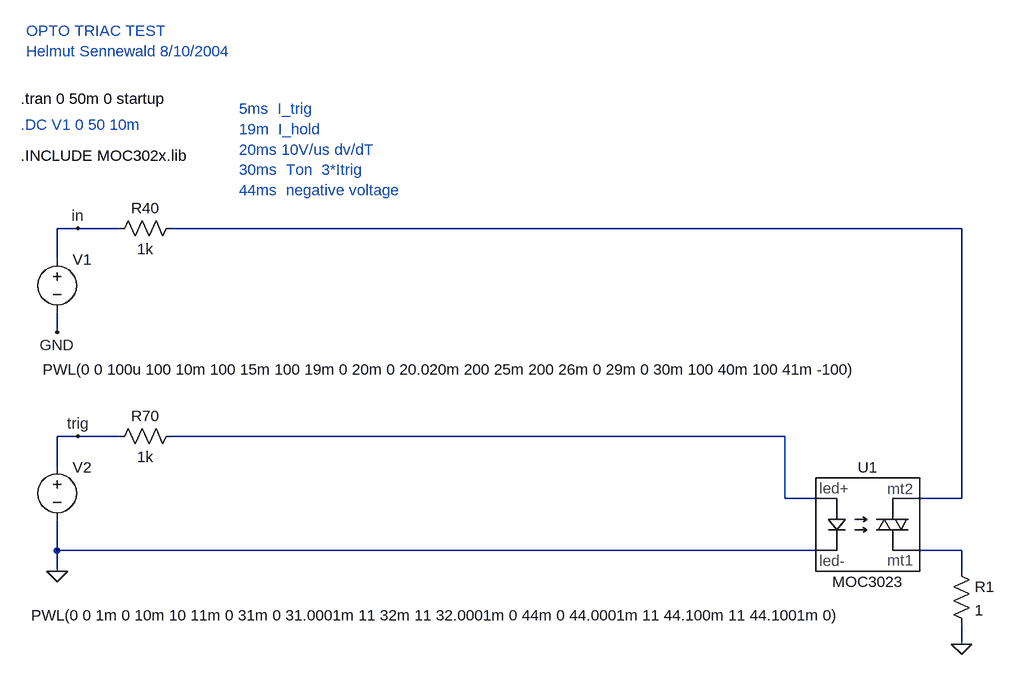
[diagram p0: schematic moc302x_test.asc]
moc302x_test.asc, the LTspice schematic file:
Version 4
SHEET 1 2328 1460
WIRE 80 448 80 400
WIRE 80 400 112 400
WIRE 80 528 80 560
WIRE 1472 400 256 400
WIRE 80 848 80 896
WIRE 176 720 112 720
WIRE 80 896 1248 896
WIRE 1200 720 256 720
WIRE 1248 816 1200 816
WIRE 1200 816 1200 720
WIRE 80 768 80 720
WIRE 1408 816 1472 816
WIRE 1472 816 1472 400
WIRE 1408 896 1472 896
WIRE 80 896 80 928
WIRE 1472 928 1472 896
WIRE 1472 1008 1472 1040
WIRE 112 400 176 400
WIRE 112 720 80 720
FLAG 80 560 GND
FLAG 80 928 0
FLAG 1472 1040 0
FLAG 112 400 in
FLAG 112 720 trig
SYMBOL res 160 416 R270
WINDOW 0 32 56 VTop 0
WINDOW 3 0 56 VBottom 0
SYMATTR InstName R40
SYMATTR Value 1k
SYMBOL voltage 80 432 R0
WINDOW 39 0 0 Left 0
WINDOW 123 0 0 Left 0
WINDOW 3 -22 185 Left 0
SYMATTR Value PWL(0 0 100u 100 10m 100 15m 100 19m 0 20m 0 20.020m 200 25m 200 26m 0 29m 0 30m 100 40m 100 41m -100)
SYMATTR InstName V1
SYMBOL voltage 80 752 R0
WINDOW 123 0 0 Left 0
WINDOW 39 0 0 Left 0
WINDOW 3 -40 244 Left 0
SYMATTR Value PWL(0 0 1m 0 10m 10 11m 0 31m 0 31.0001m 11 32m 11 32.0001m 0 44m 0 44.0001m 11 44.100m 11 44.1001m 0)
SYMATTR InstName V2
SYMBOL res 160 736 R270
WINDOW 0 32 56 VTop 0
WINDOW 3 0 56 VBottom 0
SYMATTR InstName R70
SYMATTR Value 1k
SYMBOL D:\\WUTemp\\MOC3023\ TRIAC\ DIAC\\LED_TRIAC 1296 832 R0
SYMATTR SpiceModel MOC3023
SYMATTR InstName U1
SYMBOL res 1456 912 R0
SYMATTR InstName R1
SYMATTR Value 1
TEXT 24 240 Left 0 ;.DC V1 0 50 10m
TEXT 24 200 Left 0 !.tran 0 50m 0 startup
TEXT 24 288 Left 0 !.INCLUDE MOC302x.lib
TEXT 360 216 Left 0 ;5ms  I_trig  \n19m  I_hold\n20ms 10V/us dv/dT\n30ms  Ton  3*Itrig\n44ms  negative voltage
TEXT 32 96 Left 0 ;OPTO TRIAC TEST\nHelmut Sennewald 8/10/2004

The netlist it stands for:
* moc302x_test.asc
R40 in N001 1k
V1 in GND PWL(0 0 100u 100 10m 100 15m 100 19m 0 20m 0 20.020m 200 25m 200 26m 0 29m 0 30m 100 40m 100 41m -100)
V2 trig 0 PWL(0 0 1m 0 10m 10 11m 0 31m 0 31.0001m 11 32m 11 32.0001m 0 44m 0 44.0001m 11 44.100m 11 44.1001m 0)
R70 trig N002 1k
XU1 N002 0 N001 N003 MOC3023  ; pins led+ led- mt2 mt1
R1 N003 0 1
* .DC V1 0 50 10m
.tran 0 50m 0 startup
.INCLUDE MOC302x.lib
* 5ms  I_trig
* 19m  I_hold
* 20ms 10V/us dv/dT
* 30ms  Ton  3*Itrig
* 44ms  negative voltage
* OPTO TRIAC TEST
* Helmut Sennewald 8/10/2004
.backanno
.end